# Altium schematic sheet mcu.SchDoc: Falcon MCU
size B; DrawnBy: Joey Tomlinson; Engineer: Joey Tomlinson; Revision: 2; PageSetup: Record=PageOptions|CenterHorizontal=True|CenterVertical=True|PrintScale=1.54|XCorrection=1.00|YCorrection=1.00|PrintKind=1|BorderSize=5000000|LeftOffset=0|BottomOffset=0|Orientation=2|PaperLength=1000|PaperWidth=1000|Scale=100|PaperSource=7|PrintQuality=-4|MediaType=1|DitherType=10|PaperKind=A2|PrintScaleMode=1
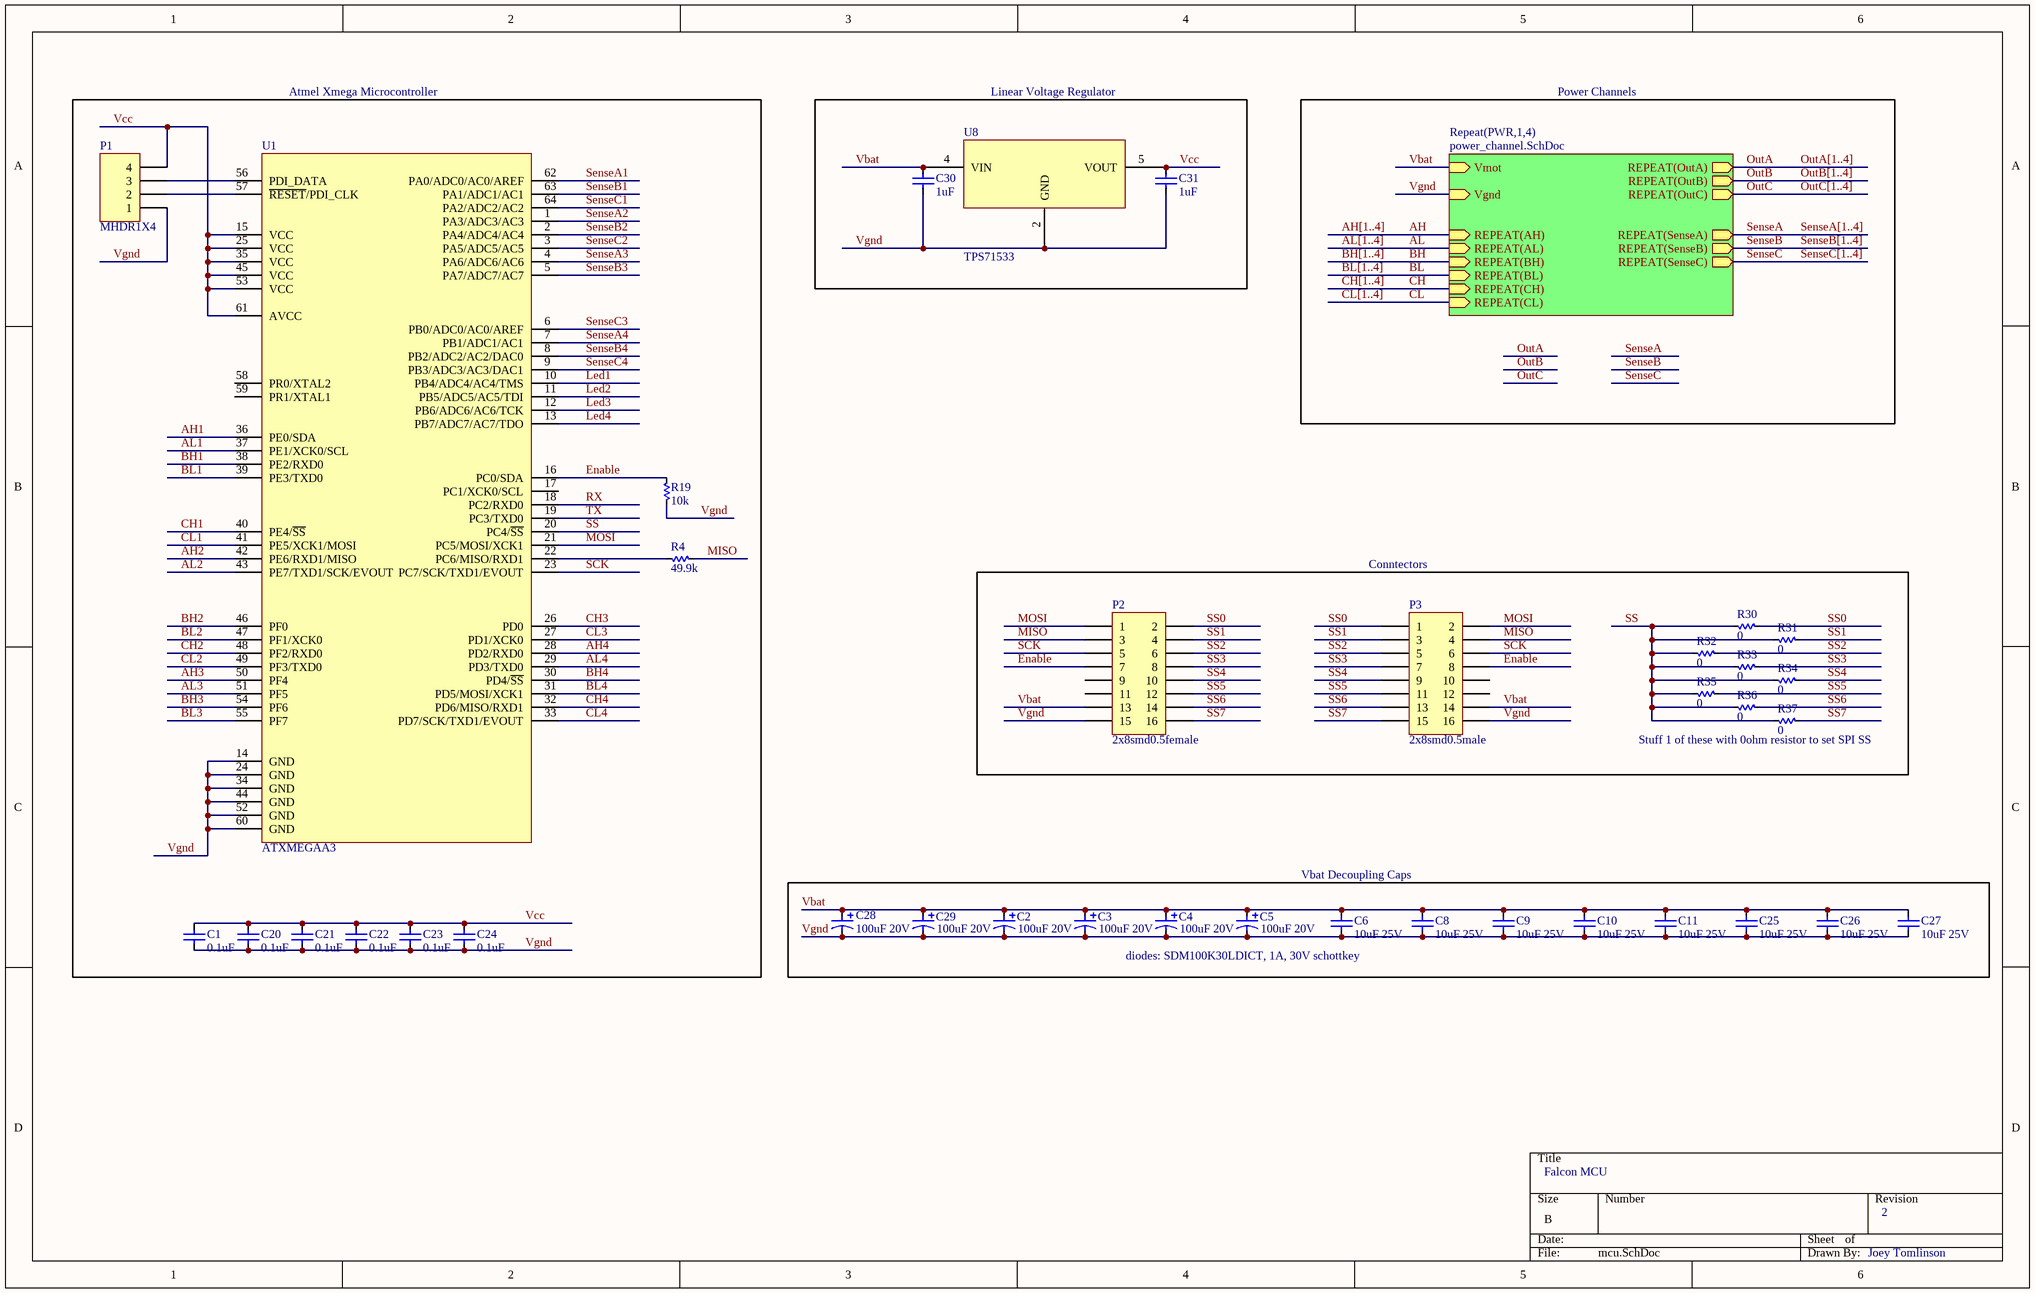
[diagram p0: mcu.SchDoc]

## Parts
C1  value 0.1uF  [0603 (1608)]  (hidden comment: Capacitor)
C2  value 100uF 20V  [7343 (TANT E)]  (hidden comment: Polarized Capacitor)
C3  value 100uF 20V  [7343 (TANT E)]  (hidden comment: Polarized Capacitor)
C4  value 100uF 20V  [7343 (TANT E)]  (hidden comment: Polarized Capacitor)
C5  value 100uF 20V  [7343 (TANT E)]  (hidden comment: Polarized Capacitor)
C6  value 10uF 25V  [0805 (2012)]  (hidden comment: Capacitor)
C8  value 10uF 25V  [0805 (2012)]  (hidden comment: Capacitor)
C9  value 10uF 25V  [0805 (2012)]  (hidden comment: Capacitor)
C10  value 10uF 25V  [0805 (2012)]  (hidden comment: Capacitor)
C11  value 10uF 25V  [0805 (2012)]  (hidden comment: Capacitor)
C20  value 0.1uF  [0603 (1608)]  (hidden comment: Capacitor)
C21  value 0.1uF  [0603 (1608)]  (hidden comment: Capacitor)
C22  value 0.1uF  [0603 (1608)]  (hidden comment: Capacitor)
C23  value 0.1uF  [0603 (1608)]  (hidden comment: Capacitor)
C24  value 0.1uF  [0603 (1608)]  (hidden comment: Capacitor)
C25  value 10uF 25V  [0805 (2012)]  (hidden comment: Capacitor)
C26  value 10uF 25V  [0805 (2012)]  (hidden comment: Capacitor)
C27  value 10uF 25V  [0805 (2012)]  (hidden comment: Capacitor)
C28  value 100uF 20V  [7343 (TANT E)]  (hidden comment: Polarized Capacitor)
C29  value 100uF 20V  [7343 (TANT E)]  (hidden comment: Polarized Capacitor)
C30  value 1uF  [0603 (1608)]  (hidden comment: Capacitor)
C31  value 1uF  [0603 (1608)]  (hidden comment: Capacitor)
P1  MHDR1X4  [MHDR1X4]
P2  2x8smd0.5female  [S9007E-08-ND]
P3  2x8smd0.5male  [S9007E-08-ND]
R4  value 49.9k  [0603 (1608)]  (hidden comment: Resistor)
R19  value 10k  [0603 (1608)]  (hidden comment: Resistor)
R30  value 0  [0603 (1608)]  (hidden comment: Resistor)
R31  value 0  [0603 (1608)]  (hidden comment: Resistor)
R32  value 0  [0603 (1608)]  (hidden comment: Resistor)
R33  value 0  [0603 (1608)]  (hidden comment: Resistor)
R34  value 0  [0603 (1608)]  (hidden comment: Resistor)
R35  value 0  [0603 (1608)]  (hidden comment: Resistor)
R36  value 0  [0603 (1608)]  (hidden comment: Resistor)
R37  value 0  [0603 (1608)]  (hidden comment: Resistor)
U1  ATXMEGAA3  [QFN-64]
U8  TPS71533  [SOT23-5]

## Blocks framed on the sheet
Atmel Xmega Microcontroller: C1 C20-C24 P1 R4 R19 U1
Linear Voltage Regulator: C30 C31 U8

## Sub-sheets
Repeat(PWR,1,4) = power_channel.SchDoc: Vmot (in), REPEAT(AH) (in), REPEAT(AL) (in), REPEAT(BH) (in), REPEAT(BL) (in), REPEAT(CH) (in), REPEAT(CL) (in), REPEAT(OutA) (out), REPEAT(OutB) (out), REPEAT(OutC) (out), REPEAT(SenseA) (out), REPEAT(SenseB) (out), REPEAT(SenseC) (out), Vgnd (in)

## Nets
AH: sheet Repeat(PWR,1,4)/REPEAT(AH)
AH1: U1.36(PE0/SDA)
AH2: U1.42(PE6/RXD1/MISO)
AH3: U1.50(PF4)
AH4: U1.28(PD2/RXD0)
AL: sheet Repeat(PWR,1,4)/REPEAT(AL)
AL1: U1.37(PE1/XCK0/SCL)
AL2: U1.43(PE7/TXD1/SCK/EVOUT)
AL3: U1.51(PF5)
AL4: U1.29(PD3/TXD0)
BH: sheet Repeat(PWR,1,4)/REPEAT(BH)
BH1: U1.38(PE2/RXD0)
BH2: U1.46(PF0)
BH3: U1.54(PF6)
BH4: U1.30(PD4/~{SS})
BL: sheet Repeat(PWR,1,4)/REPEAT(BL)
BL1: U1.39(PE3/TXD0)
BL2: U1.47(PF1/XCK0)
BL3: U1.55(PF7)
BL4: U1.31(PD5/MOSI/XCK1)
CH: sheet Repeat(PWR,1,4)/REPEAT(CH)
CH1: U1.40(PE4/~{SS})
CH2: U1.48(PF2/RXD0)
CH3: U1.26(PD0)
CH4: U1.32(PD6/MISO/RXD1)
CL: sheet Repeat(PWR,1,4)/REPEAT(CL)
CL1: U1.41(PE5/XCK1/MOSI)
CL2: U1.49(PF3/TXD0)
CL3: U1.27(PD1/XCK0)
CL4: U1.33(PD7/SCK/TXD1/EVOUT)
Enable: P2.7 P3.8 R19.2 U1.16(PC0/SDA)
Led1: U1.10(PB4/ADC4/AC4/TMS)
Led2: U1.11(PB5/ADC5/AC5/TDI)
Led3: U1.12(PB6/ADC6/AC6/TCK)
Led4: U1.13(PB7/ADC7/AC7/TDO)
MISO: P2.3 P3.4 R4.1
MOSI: P2.1 P3.2 U1.21(PC5/MOSI/XCK1)
OutA: sheet Repeat(PWR,1,4)/REPEAT(OutA)
OutB: sheet Repeat(PWR,1,4)/REPEAT(OutB)
OutC: sheet Repeat(PWR,1,4)/REPEAT(OutC)
RX: U1.18(PC2/RXD0)
SCK: P2.5 P3.6 U1.23(PC7/SCK/TXD1/EVOUT)
SenseA: sheet Repeat(PWR,1,4)/REPEAT(SenseA)
SenseA1: U1.62(PA0/ADC0/AC0/AREF)
SenseA2: U1.1(PA3/ADC3/AC3)
SenseA3: U1.4(PA6/ADC6/AC6)
SenseA4: U1.7(PB1/ADC1/AC1)
SenseB: sheet Repeat(PWR,1,4)/REPEAT(SenseB)
SenseB1: U1.63(PA1/ADC1/AC1)
SenseB2: U1.2(PA4/ADC4/AC4)
SenseB3: U1.5(PA7/ADC7/AC7)
SenseB4: U1.8(PB2/ADC2/AC2/DAC0)
SenseC: sheet Repeat(PWR,1,4)/REPEAT(SenseC)
SenseC1: U1.64(PA2/ADC2/AC2)
SenseC2: U1.3(PA5/ADC5/AC5)
SenseC3: U1.6(PB0/ADC0/AC0/AREF)
SenseC4: U1.9(PB3/ADC3/AC3/DAC1)
SS: R30.1 R31.1 R32.1 R33.1 R34.1 R35.1 R36.1 R37.1 U1.20(PC4/~{SS})
SS0: P2.2 P3.1 R30.2
SS1: P2.4 P3.3 R31.2
SS2: P2.6 P3.5 R32.2
SS3: P2.8 P3.7 R33.2
SS4: P2.10 P3.9 R34.2
SS5: P2.12 P3.11 R35.2
SS6: P2.14 P3.13 R36.2
SS7: P2.16 P3.15 R37.2
TX: U1.19(PC3/TXD0)
Vbat: C2.1 C3.1 C4.1 C5.1 C6.1 C8.1 C9.1 C10.1 C11.1 C25.1 C26.1 C27.1 C28.1 C29.1 C30.1 P2.13 P3.14 U8.4(VIN) ; sheet Repeat(PWR,1,4)/Vmot
Vcc: C1.1 C20.1 C21.1 C22.1 C23.1 C24.1 C31.1 P1.4 U1.15(VCC) U1.25(VCC) U1.35(VCC) U1.45(VCC) U1.53(VCC) U1.61(AVCC) U8.5(VOUT)
Vgnd: C1.2 C2.2 C3.2 C4.2 C5.2 C6.2 C8.2 C9.2 C10.2 C11.2 C20.2 C21.2 C22.2 C23.2 C24.2 C25.2 C26.2 C27.2 C28.2 C29.2 C30.2 C31.2 P1.1 P2.15 P3.16 R19.1 U1.14(GND) U1.24(GND) U1.34(GND) U1.44(GND) U1.52(GND) U1.60(GND) U8.2(GND) ; sheet Repeat(PWR,1,4)/Vgnd
NetP1_2: P1.2 U1.57(~{RESET}/PDI_CLK)
NetP1_3: P1.3 U1.56(PDI_DATA)
NetR4_2: R4.2 U1.22(PC6/MISO/RXD1)

Not connected (* = marked no-connect by the designer): P2 9 11; P3 10 12; U1 17(PC1/XCK0/SCL) 58(PR0/XTAL2) 59(PR1/XTAL1)

## Buses and harness runs
bus AH[1..4]
bus AL[1..4]
bus BH[1..4]
bus BL[1..4]
bus CH[1..4]
bus CL[1..4]
bus OutA[1..4]
bus OutB[1..4]
bus OutC[1..4]
bus SenseA[1..4]
bus SenseB[1..4]
bus SenseC[1..4]

## Notes on the sheet
- Power Channels
- Conntectors
- (near R37) Stuff 1 of these with 0ohm resistor to set SPI SS
- Vbat Decoupling Caps
- diodes: SDM100K30LDICT, 1A, 30V schottkey

## Library data of the parts
C1 C20-C24 = Capacitor: Part No.: 490-1524-1-ND; Vendor: Digikey; Price Est.: 0.019
C2-C5 C28 C29 = Polarized Capacitor: Part No.: 718-1370-1-ND; Vendor: Digikey
C6 C8-C11 C25-C27 = Capacitor: Part No.: 490-5523-1-ND; Vendor: Digikey; Price Est.: $0.10
C30 C31 = Capacitor: Part No.: 445-3452-1-ND; Vendor: Digikey; Price Est.: 0.061
P1 = MHDR1X4: Header, 4-Pin; Part No.: Not Stuffed; LatestRevisionDate: 17-Jul-2002; LatestRevisionNote: Re-released for DXP Platform.; Publisher: Altium Limited
P2 = 2x8smd0.5female: Vendor: Digikey; Part No.: S9007E-08-ND; Price Est.: 1.43
P3 = 2x8smd0.5male: Part No.: S9013E-08-ND; Vendor: Digikey; Price Est.: 1.43
R4 = Resistor: Part No.: P49.9HCT-ND; Vendor: Digikey; Price Est.: 0.02
R19 = Resistor: Part No.: RMCF0603JT10K0CT-ND; Vendor: Digikey; Price Est.: 0.02
R30-R37 = Resistor: Part No.: RMCF0603ZT0R00CT-ND; Vendor: Digikey; Price Est.: 0.02
U1 = ATXMEGAA3: Manufacturer: Atmel; Part No.: ATXMEGA128A3-MH-ND; Vendor: Digikey; Price Est.: 10.43
U8 = TPS71533: Part No.: 296-12008-1-ND; Vendor: Digikey; Price Est.: 1.29